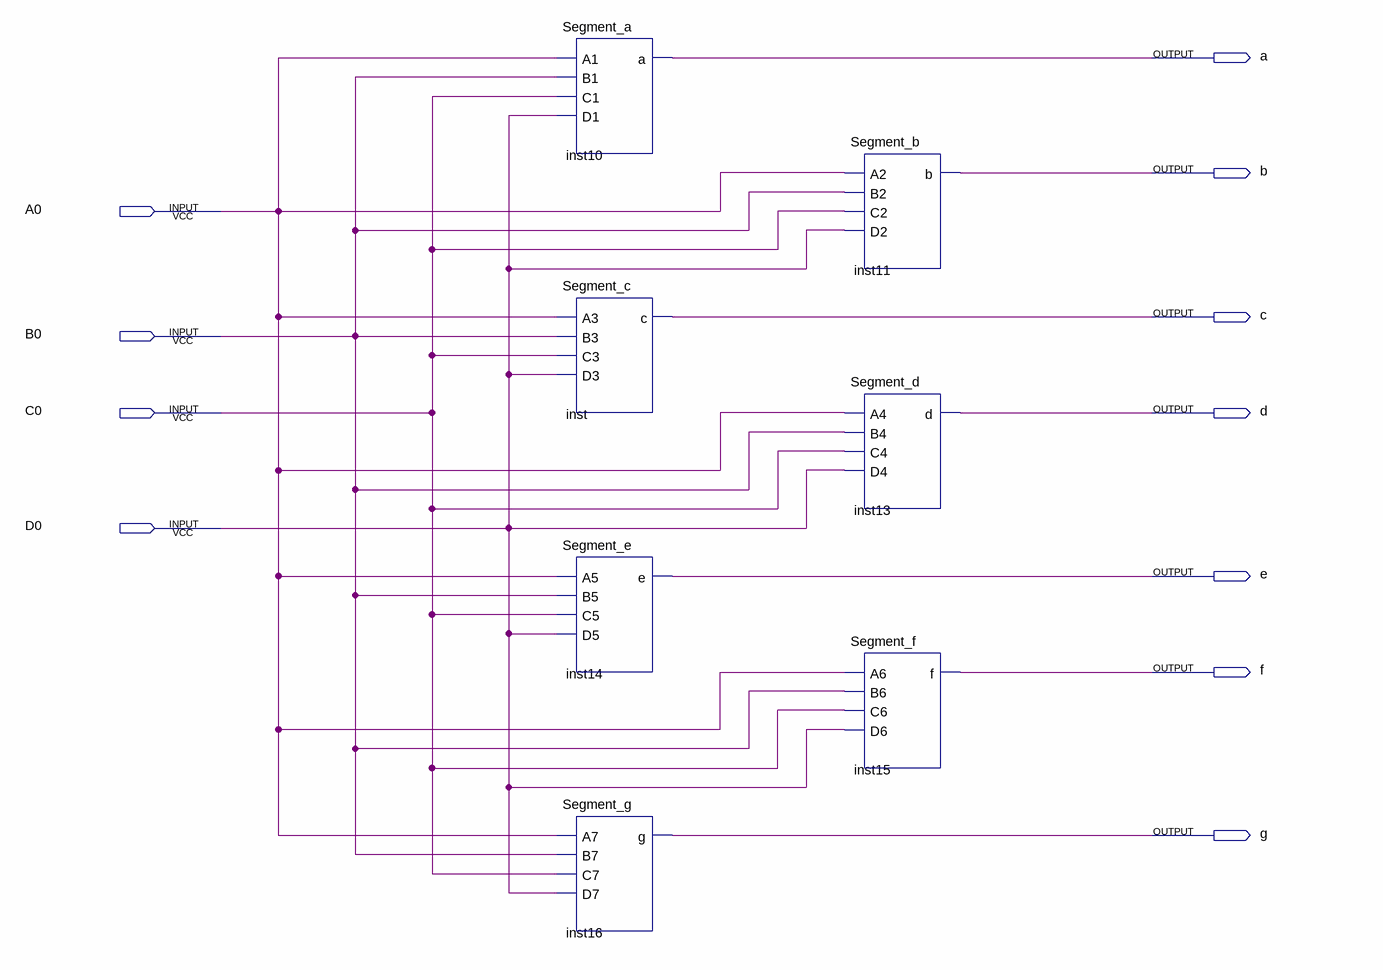
[diagram p0: schematic sheet]
// Quartus schematic 7SEGM.bdf as structural Verilog: 7 symbols, 11 pins
module \7SEGM  (
  input  A0,
  input  B0,
  input  C0,
  input  D0,
  output a,
  output b,
  output c,
  output d,
  output e,
  output f,
  output g
);

  Segment_a inst10 (.A1(A0), .B1(B0), .C1(C0), .D1(D0), .a(a));
  Segment_c inst (.A3(A0), .B3(B0), .C3(C0), .D3(D0), .c(c));
  Segment_e inst14 (.A5(A0), .B5(B0), .C5(C0), .D5(D0), .e(e));
  Segment_g inst16 (.A7(A0), .B7(B0), .C7(C0), .D7(D0), .g(g));
  Segment_b inst11 (.A2(A0), .B2(B0), .C2(C0), .D2(D0), .b(b));
  Segment_d inst13 (.A4(A0), .B4(B0), .C4(C0), .D4(D0), .d(d));
  Segment_f inst15 (.A6(A0), .B6(B0), .C6(C0), .D6(D0), .f(f));
endmodule
